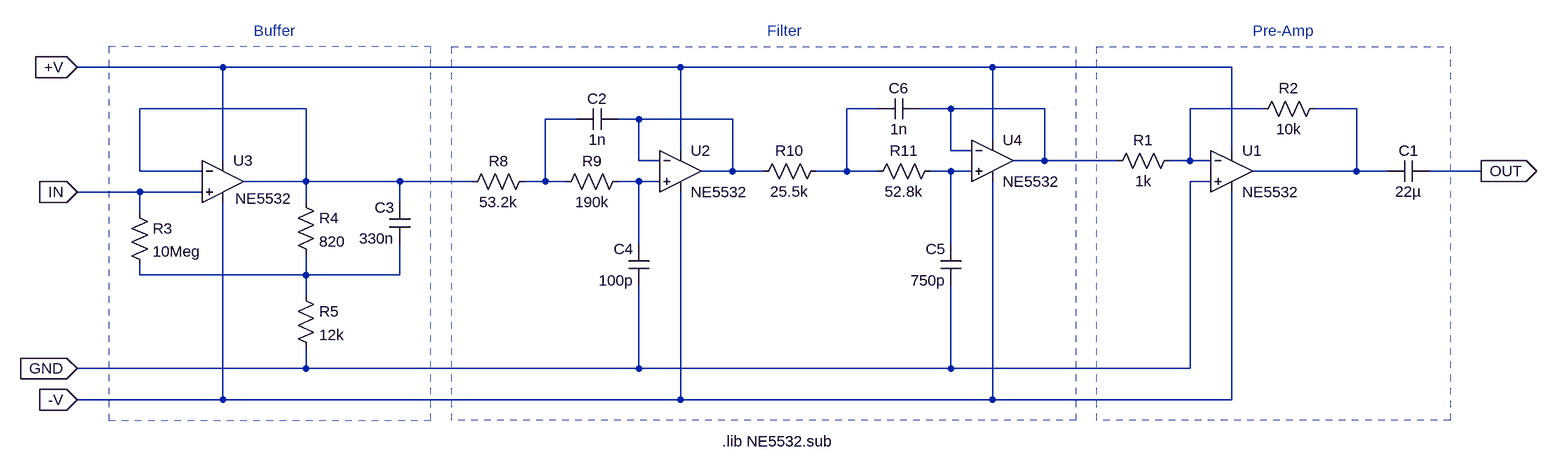
[diagram p0: schematic IPS_2.asc]
IPS_2.asc, the LTspice schematic file:
Version 4
SHEET 1 2132 680
WIRE -320 -112 -544 -112
WIRE 384 -112 -320 -112
WIRE 864 -112 384 -112
WIRE 1232 -112 864 -112
WIRE -192 -48 -448 -48
WIRE 688 -48 640 -48
WIRE 800 -48 752 -48
WIRE 944 -48 800 -48
WIRE 1280 -48 1168 -48
WIRE 1424 -48 1360 -48
WIRE 224 -32 176 -32
WIRE 320 -32 288 -32
WIRE 464 -32 320 -32
WIRE 864 0 864 -112
WIRE 384 16 384 -112
WIRE 800 16 800 -48
WIRE 832 16 800 16
WIRE 1232 16 1232 -112
WIRE -320 32 -320 -112
WIRE 320 32 320 -32
WIRE 352 32 320 32
WIRE 944 32 944 -48
WIRE 944 32 896 32
WIRE 1056 32 944 32
WIRE 1168 32 1168 -48
WIRE 1168 32 1136 32
WIRE 1200 32 1168 32
WIRE -448 48 -448 -48
WIRE -352 48 -448 48
WIRE 464 48 464 -32
WIRE 464 48 416 48
WIRE 512 48 464 48
WIRE 640 48 640 -48
WIRE 640 48 592 48
WIRE 688 48 640 48
WIRE 800 48 768 48
WIRE 832 48 800 48
WIRE 1424 48 1424 -48
WIRE 1424 48 1264 48
WIRE 1472 48 1424 48
WIRE 1616 48 1536 48
WIRE -192 64 -192 -48
WIRE -192 64 -288 64
WIRE -48 64 -192 64
WIRE 64 64 -48 64
WIRE 176 64 176 -32
WIRE 176 64 144 64
WIRE 208 64 176 64
WIRE 320 64 288 64
WIRE 352 64 320 64
WIRE 1200 64 1168 64
WIRE -448 80 -544 80
WIRE -352 80 -448 80
WIRE -192 96 -192 64
WIRE -48 96 -48 64
WIRE -448 112 -448 80
WIRE 320 160 320 64
WIRE 800 160 800 48
WIRE -448 208 -448 192
WIRE -192 208 -192 176
WIRE -192 208 -448 208
WIRE -48 208 -48 160
WIRE -48 208 -192 208
WIRE -192 240 -192 208
WIRE -192 352 -192 320
WIRE -192 352 -544 352
WIRE 320 352 320 224
WIRE 320 352 -192 352
WIRE 800 352 800 224
WIRE 800 352 320 352
WIRE 1168 352 1168 64
WIRE 1168 352 800 352
WIRE -320 400 -320 96
WIRE -320 400 -544 400
WIRE 384 400 384 80
WIRE 384 400 -320 400
WIRE 864 400 864 64
WIRE 864 400 384 400
WIRE 1232 400 1232 80
WIRE 1232 400 864 400
FLAG -544 80 IN
IOPIN -544 80 In
FLAG -544 352 GND
IOPIN -544 352 In
FLAG -544 -112 +V
IOPIN -544 -112 In
FLAG -544 400 -V
IOPIN -544 400 In
FLAG 1616 48 OUT
IOPIN 1616 48 Out
SYMBOL OpAmps\\opamp2 1232 -16 R0
SYMATTR InstName U1
SYMATTR Value NE5532
SYMBOL res 1152 16 R90
WINDOW 0 0 56 VBottom 2
WINDOW 3 32 56 VTop 2
SYMATTR InstName R1
SYMATTR Value 1k
SYMBOL res 1376 -64 R90
WINDOW 0 0 56 VBottom 2
WINDOW 3 32 56 VTop 2
SYMATTR InstName R2
SYMATTR Value 10k
SYMBOL cap 1536 32 R90
WINDOW 0 0 32 VBottom 2
WINDOW 3 32 32 VTop 2
SYMATTR InstName C1
SYMATTR Value 22µ
SYMBOL res -464 96 R0
SYMATTR InstName R3
SYMATTR Value 10Meg
SYMBOL OpAmps\\opamp2 -320 0 R0
WINDOW 3 19 90 Left 2
SYMATTR Value NE5532
SYMATTR InstName U3
SYMBOL cap -32 160 R180
WINDOW 0 24 56 Left 2
WINDOW 3 24 8 Left 2
SYMATTR InstName C3
SYMATTR Value 330n
SYMBOL res -208 80 R0
SYMATTR InstName R4
SYMATTR Value 820
SYMBOL res -208 224 R0
SYMATTR InstName R5
SYMATTR Value 12k
SYMBOL OpAmps\\opamp2 384 -16 R0
SYMATTR InstName U2
SYMATTR Value NE5532
SYMBOL OpAmps\\opamp2 864 -32 R0
SYMATTR InstName U4
SYMATTR Value NE5532
SYMBOL res 160 48 R90
WINDOW 0 0 56 VBottom 2
WINDOW 3 32 56 VTop 2
SYMATTR InstName R8
SYMATTR Value 53.2k
SYMBOL res 304 48 R90
WINDOW 0 0 56 VBottom 2
WINDOW 3 32 56 VTop 2
SYMATTR InstName R9
SYMATTR Value 190k
SYMBOL cap 288 -48 R90
WINDOW 0 0 32 VBottom 2
WINDOW 3 32 32 VTop 2
SYMATTR InstName C2
SYMATTR Value 1n
SYMBOL cap 336 224 R180
WINDOW 0 24 56 Left 2
WINDOW 3 24 8 Left 2
SYMATTR InstName C4
SYMATTR Value 100p
SYMBOL res 608 32 R90
WINDOW 0 0 56 VBottom 2
WINDOW 3 32 56 VTop 2
SYMATTR InstName R10
SYMATTR Value 25.5k
SYMBOL res 784 32 R90
WINDOW 0 0 56 VBottom 2
WINDOW 3 32 56 VTop 2
SYMATTR InstName R11
SYMATTR Value 52.8k
SYMBOL cap 752 -64 R90
WINDOW 0 0 32 VBottom 2
WINDOW 3 32 32 VTop 2
SYMATTR InstName C6
SYMATTR Value 1n
SYMBOL cap 816 224 R180
WINDOW 0 24 56 Left 2
WINDOW 3 24 8 Left 2
SYMATTR InstName C5
SYMATTR Value 750p
TEXT 448 464 Left 2 !.lib NE5532.sub
TEXT -240 -168 Center 2 ;Buffer
TEXT 1312 -168 Center 2 ;Pre-Amp
TEXT 544 -168 Center 2 ;Filter
RECTANGLE Normal -496 432 0 -144 2
RECTANGLE Normal 992 432 32 -144 2
RECTANGLE Normal 1568 432 1024 -144 2

The netlist it stands for:
* IPS_2.asc
XU1 GND N004 +V -V N005 NE5532  ; pins In+ In- V+ V- OUT
R1 N004 N003 1k
R2 N005 N004 10k
C1 OUT N005 22µ
R3 IN N010 10Meg
XU3 IN N001 +V -V N001 NE5532  ; pins In+ In- V+ V- OUT
C3 N010 N001 330n
R4 N001 N010 820
R5 N010 GND 12k
XU2 N009 N007 +V -V N007 NE5532  ; pins In+ In- V+ V- OUT
XU4 N008 N003 +V -V N003 NE5532  ; pins In+ In- V+ V- OUT
R8 N006 N001 53.2k
R9 N009 N006 190k
C2 N007 N006 1n
C4 GND N009 100p
R10 N002 N007 25.5k
R11 N008 N002 52.8k
C6 N003 N002 1n
C5 GND N008 750p
.lib NE5532.sub
* Buffer
* Pre-Amp
* Filter
.backanno
.end